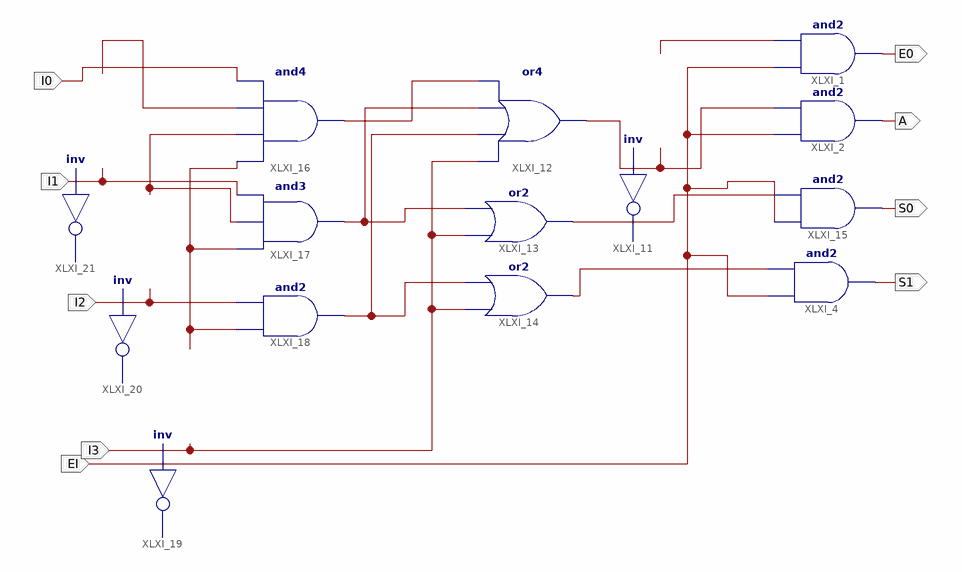
[diagram p0: schematic sheet 1]
// Xilinx ISE schematic CODIF42.sch (spartan3e) as structural Verilog: 14 symbols, 9 ports
module CODIF42 (
  input  EI,
  input  I3,
  input  I2,
  input  I1,
  input  I0,
  output S1,
  output E0,
  output S0,
  output A
);

  wire XLXN_9, XLXN_23, XLXN_25, XLXN_27, XLXN_28, XLXN_30, XLXN_31, XLXN_38, XLXN_39, XLXN_40;

  and XLXI_4 (S1, EI, XLXN_25);
  and XLXI_1 (E0, EI, XLXN_9);
  and XLXI_2 (A, EI, XLXN_23);
  not XLXI_11 (XLXN_9, XLXN_23);
  or XLXI_12 (XLXN_23, I3, XLXN_30, XLXN_31, XLXN_28);
  or XLXI_13 (XLXN_27, I3, XLXN_31);
  or XLXI_14 (XLXN_25, I3, XLXN_30);
  and XLXI_15 (S0, EI, XLXN_27);
  and XLXI_16 (XLXN_28, XLXN_38, XLXN_39, XLXN_40, I0);
  and XLXI_17 (XLXN_31, XLXN_38, XLXN_39, I1);
  and XLXI_18 (XLXN_30, XLXN_38, I2);
  not XLXI_19 (XLXN_38, I3);
  not XLXI_20 (XLXN_39, I2);
  not XLXI_21 (XLXN_40, I1);
endmodule
